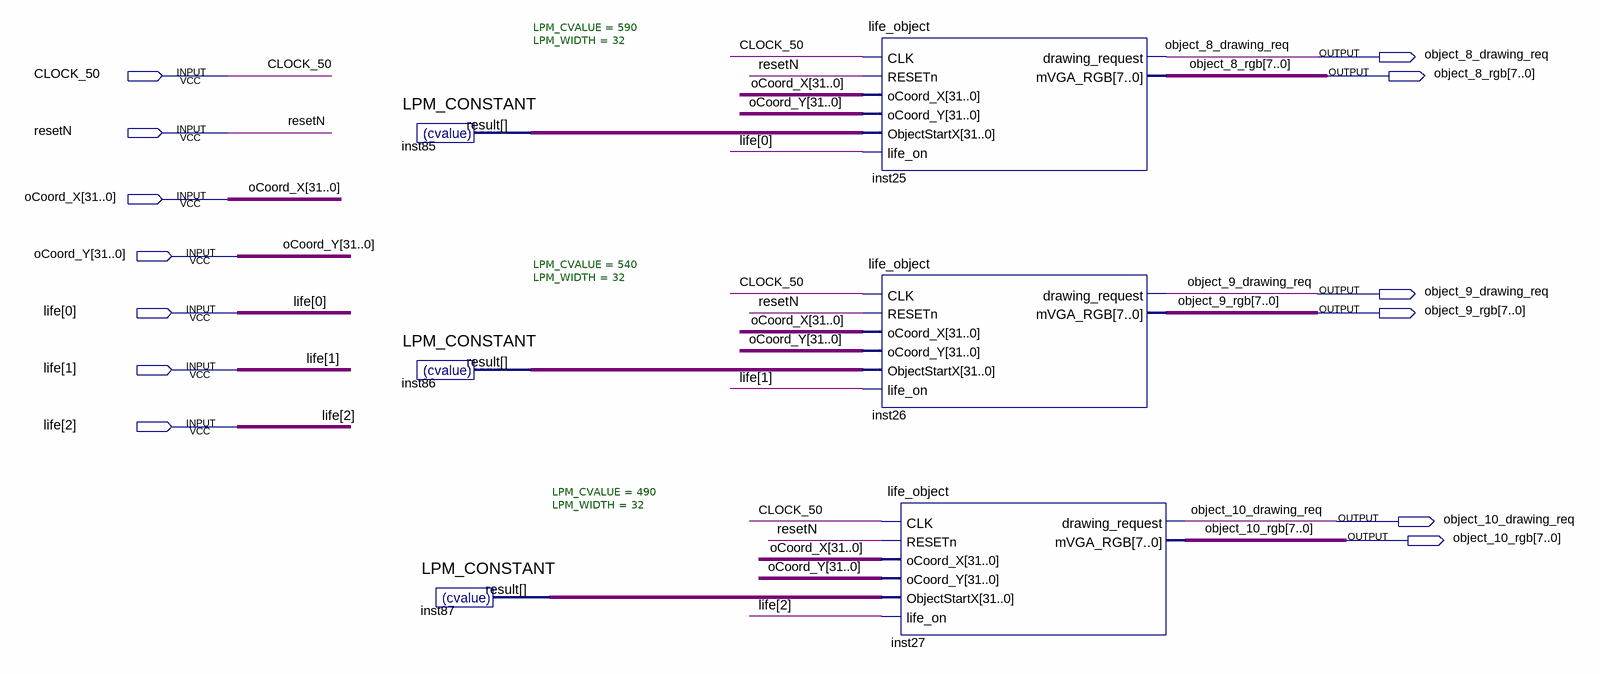
[diagram p0: schematic sheet]
// Quartus schematic life_top.bdf as structural Verilog: 6 symbols, 13 pins
module life_top (
  input  CLOCK_50,
  input  resetN,
  input  [31:0] oCoord_X,
  input  [31:0] oCoord_Y,
  input  [2:0] life,
  output object_8_drawing_req,
  output [7:0] object_8_rgb,
  output object_9_drawing_req,
  output [7:0] object_9_rgb,
  output object_10_drawing_req,
  output [7:0] object_10_rgb
);

  wire [31:0] inst85_result, inst86_result, inst87_result;

  LPM_CONSTANT #(.LPM_CVALUE(590), .LPM_WIDTH(32)) inst85 (.result(inst85_result));
  LPM_CONSTANT #(.LPM_CVALUE(540), .LPM_WIDTH(32)) inst86 (.result(inst86_result));
  LPM_CONSTANT #(.LPM_CVALUE(490), .LPM_WIDTH(32)) inst87 (.result(inst87_result));
  life_object inst25 (
    .CLK(CLOCK_50), .RESETn(resetN), .oCoord_X(oCoord_X), .oCoord_Y(oCoord_Y), .ObjectStartX(inst85_result),
    .life_on(life[0]), .drawing_request(object_8_drawing_req), .mVGA_RGB(object_8_rgb));
  life_object inst26 (
    .CLK(CLOCK_50), .RESETn(resetN), .oCoord_X(oCoord_X), .oCoord_Y(oCoord_Y), .ObjectStartX(inst86_result),
    .life_on(life[1]), .drawing_request(object_9_drawing_req), .mVGA_RGB(object_9_rgb));
  life_object inst27 (
    .CLK(CLOCK_50), .RESETn(resetN), .oCoord_X(oCoord_X), .oCoord_Y(oCoord_Y), .ObjectStartX(inst87_result),
    .life_on(life[2]), .drawing_request(object_10_drawing_req), .mVGA_RGB(object_10_rgb));
endmodule
